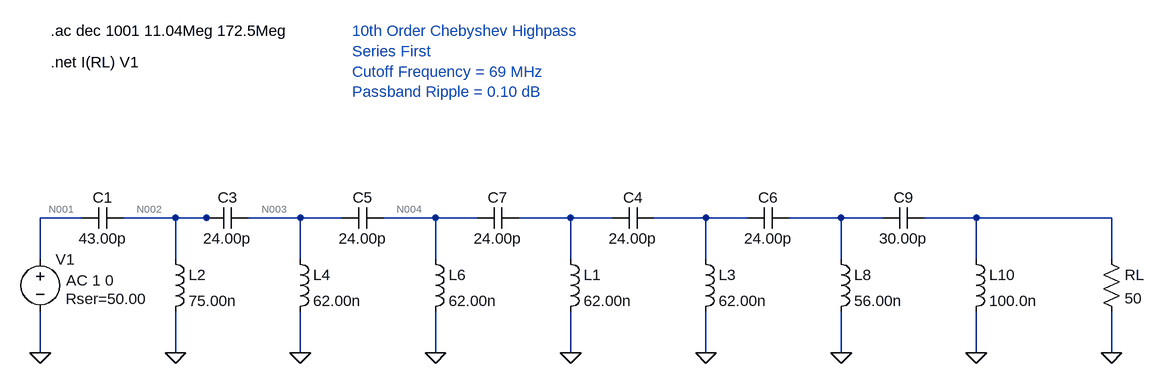
[diagram p0: schematic highpass.asc]
highpass.asc, the LTspice schematic file:
Version 4
SHEET 1 1892 676
WIRE 64 0 0 0
WIRE 208 0 128 0
WIRE 256 0 208 0
WIRE 272 0 256 0
WIRE 400 0 320 0
WIRE 464 0 400 0
WIRE 608 0 528 0
WIRE 672 0 608 0
WIRE 816 0 736 0
WIRE 880 0 816 0
WIRE 1024 0 944 0
WIRE 1088 0 1024 0
WIRE 1232 0 1152 0
WIRE 1296 0 1232 0
WIRE 1440 0 1360 0
WIRE 1648 0 1440 0
WIRE 0 64 0 0
WIRE 208 64 208 0
WIRE 400 64 400 0
WIRE 608 64 608 0
WIRE 816 64 816 0
WIRE 1024 64 1024 0
WIRE 1232 64 1232 0
WIRE 1440 64 1440 0
WIRE 1648 64 1648 0
WIRE 0 208 0 144
WIRE 208 208 208 144
WIRE 400 208 400 144
WIRE 608 208 608 144
WIRE 816 208 816 144
WIRE 1024 208 1024 144
WIRE 1232 208 1232 144
WIRE 1440 208 1440 144
WIRE 1648 208 1648 144
FLAG 0 208 0
FLAG 208 208 0
FLAG 400 208 0
FLAG 608 208 0
FLAG 1232 208 0
FLAG 1440 208 0
FLAG 1648 208 0
FLAG 816 208 0
FLAG 1024 208 0
SYMBOL voltage 0 48 R0
WINDOW 123 40 48 Left 2
WINDOW 39 39 77 Left 2
SYMATTR Value2 AC 1 0
SYMATTR SpiceLine Rser=50.00
SYMATTR InstName V1
SYMATTR Value ""
SYMBOL cap 64 16 R270
WINDOW 0 32 32 VTop 2
WINDOW 3 0 32 VBottom 2
SYMATTR InstName C1
SYMATTR Value 43.00p
SYMBOL ind 192 48 R0
SYMATTR InstName L2
SYMATTR Value 75.00n
SYMBOL cap 256 16 R270
WINDOW 0 32 32 VTop 2
WINDOW 3 0 32 VBottom 2
SYMATTR InstName C3
SYMATTR Value 24.00p
SYMBOL ind 384 48 R0
SYMATTR InstName L4
SYMATTR Value 62.00n
SYMBOL cap 464 16 R270
WINDOW 0 32 32 VTop 2
WINDOW 3 0 32 VBottom 2
SYMATTR InstName C5
SYMATTR Value 24.00p
SYMBOL ind 592 48 R0
SYMATTR InstName L6
SYMATTR Value 62.00n
SYMBOL cap 672 16 R270
WINDOW 0 32 32 VTop 2
WINDOW 3 0 32 VBottom 2
SYMATTR InstName C7
SYMATTR Value 24.00p
SYMBOL ind 1216 48 R0
SYMATTR InstName L8
SYMATTR Value 56.00n
SYMBOL cap 1296 16 R270
WINDOW 0 32 32 VTop 2
WINDOW 3 0 32 VBottom 2
SYMATTR InstName C9
SYMATTR Value 30.00p
SYMBOL ind 1424 48 R0
SYMATTR InstName L10
SYMATTR Value 100.0n
SYMBOL res 1632 48 R0
SYMATTR InstName RL
SYMATTR Value 50
SYMBOL ind 800 48 R0
SYMATTR InstName L1
SYMATTR Value 62.00n
SYMBOL cap 880 16 R270
WINDOW 0 32 32 VTop 2
WINDOW 3 0 32 VBottom 2
SYMATTR InstName C4
SYMATTR Value 24.00p
SYMBOL ind 1008 48 R0
SYMATTR InstName L3
SYMATTR Value 62.00n
SYMBOL cap 1088 16 R270
WINDOW 0 32 32 VTop 2
WINDOW 3 0 32 VBottom 2
SYMATTR InstName C6
SYMATTR Value 24.00p
TEXT 16 -288 Left 2 !.ac dec 1001 11.04Meg 172.5Meg
TEXT 16 -240 Left 2 !.net I(RL) V1
TEXT 480 -288 Left 2 ;10th Order Chebyshev Highpass\nSeries First\nCutoff Frequency = 69 MHz\nPassband Ripple = 0.10 dB

The netlist it stands for:
* highpass.asc
V1 N001 0 AC 1 0 Rser=50.00
C1 N001 N002 43.00p
L2 N002 0 75.00n
C3 N002 N003 24.00p
L4 N003 0 62.00n
C5 N003 N004 24.00p
L6 N004 0 62.00n
C7 N004 N005 24.00p
L8 N007 0 56.00n
C9 N007 N008 30.00p
L10 N008 0 100.0n
RL N008 0 50
L1 N005 0 62.00n
C4 N005 N006 24.00p
L3 N006 0 62.00n
C6 N006 N007 24.00p
.ac dec 1001 11.04Meg 172.5Meg
.net I(RL) V1
* 10th Order Chebyshev Highpass
* Series First
* Cutoff Frequency = 69 MHz
* Passband Ripple = 0.10 dB
.backanno
.end

* Results of the author's LTspice run, read from the files saved beside the schematic
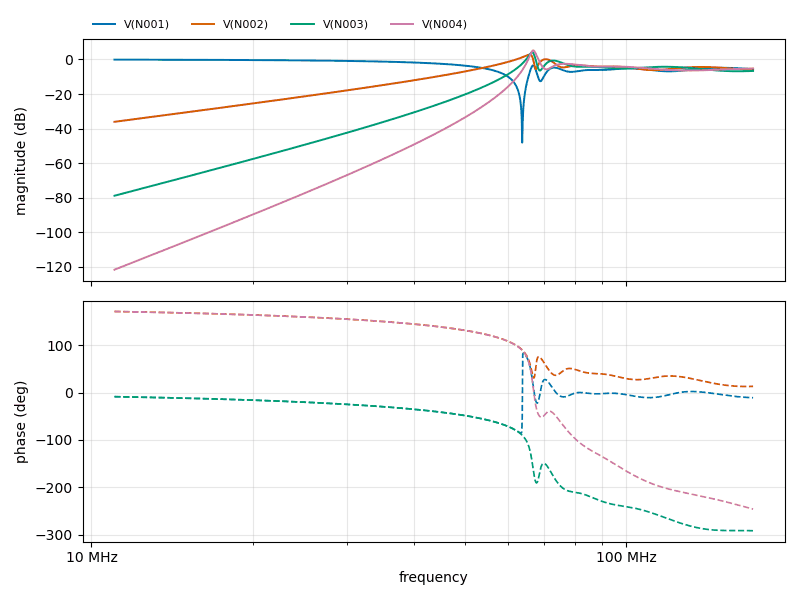
[diagram p1: AC Analysis of highpass.asc, plotted from the saved traces]
* AC Analysis, 1 run:
*   V(N001): -0.10 dB at 11.04 MHz, -5.62 dB at 172.5 MHz, peak -0.10 dB at 11.04 MHz, 3 dB below the peak at 48.04 MHz
*   V(N002): -36.07 dB at 11.04 MHz, -6.28 dB at 172.5 MHz, peak 2.80 dB at 65.95 MHz, 3 dB below the peak at 61.9 MHz and 66.96 MHz
*   V(N003): -78.85 dB at 11.04 MHz, -6.64 dB at 172.5 MHz, peak 4.10 dB at 66.71 MHz, 3 dB below the peak at 65.35 MHz and 67.49 MHz
*   V(N004): -121.62 dB at 11.04 MHz, -5.14 dB at 172.5 MHz, peak 5.24 dB at 67.02 MHz, 3 dB below the peak at 66 MHz and 67.95 MHz